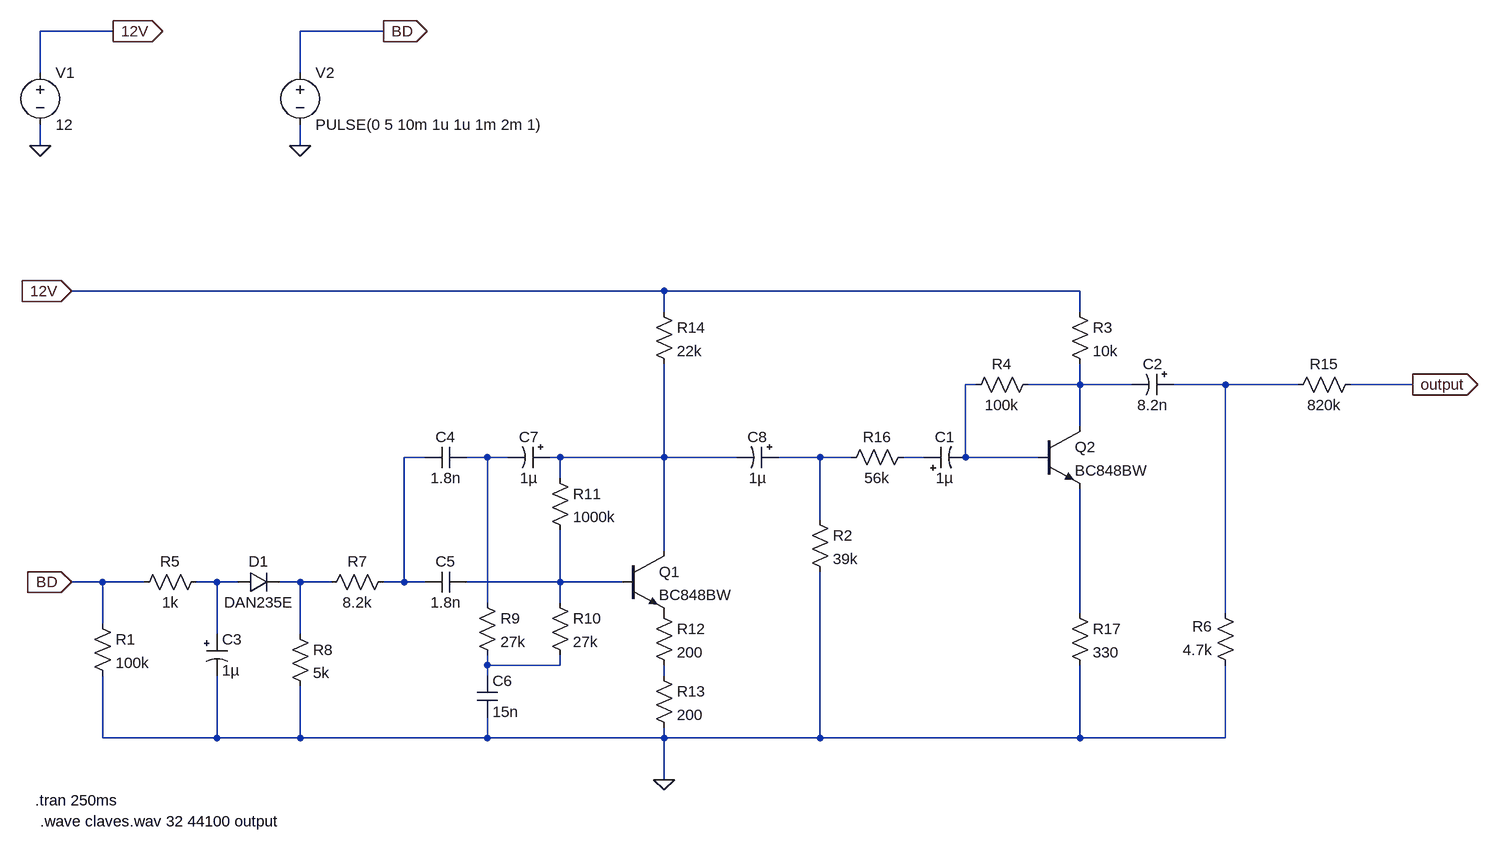
[diagram p0: schematic claves.asc]
claves.asc, the LTspice schematic file:
Version 4
SHEET 1 2960 680
WIRE 752 -880 640 -880
WIRE 1168 -880 1040 -880
WIRE 640 -816 640 -880
WIRE 1040 -816 1040 -880
WIRE 640 -704 640 -736
WIRE 1040 -704 1040 -736
WIRE 1600 -480 688 -480
WIRE 2240 -480 1600 -480
WIRE 1600 -448 1600 -480
WIRE 2240 -448 2240 -480
WIRE 2080 -336 2064 -336
WIRE 2240 -336 2240 -368
WIRE 2240 -336 2160 -336
WIRE 2320 -336 2240 -336
WIRE 2464 -336 2384 -336
WIRE 2576 -336 2464 -336
WIRE 2752 -336 2656 -336
WIRE 2240 -272 2240 -336
WIRE 1232 -224 1200 -224
WIRE 1328 -224 1296 -224
WIRE 1360 -224 1328 -224
WIRE 1440 -224 1424 -224
WIRE 1600 -224 1600 -368
WIRE 1600 -224 1440 -224
WIRE 1712 -224 1600 -224
WIRE 1840 -224 1776 -224
WIRE 1888 -224 1840 -224
WIRE 2000 -224 1968 -224
WIRE 2064 -224 2064 -336
WIRE 2176 -224 2064 -224
WIRE 1440 -192 1440 -224
WIRE 1840 -128 1840 -224
WIRE 1600 -80 1600 -224
WIRE 736 -32 688 -32
WIRE 800 -32 736 -32
WIRE 912 -32 880 -32
WIRE 944 -32 912 -32
WIRE 1040 -32 1008 -32
WIRE 1088 -32 1040 -32
WIRE 1200 -32 1200 -224
WIRE 1200 -32 1168 -32
WIRE 1232 -32 1200 -32
WIRE 1440 -32 1440 -112
WIRE 1440 -32 1296 -32
WIRE 1536 -32 1440 -32
WIRE 1328 0 1328 -224
WIRE 1440 0 1440 -32
WIRE 2240 16 2240 -176
WIRE 2464 16 2464 -336
WIRE 736 32 736 -32
WIRE 912 48 912 -32
WIRE 1040 48 1040 -32
WIRE 1328 96 1328 80
WIRE 1440 96 1440 80
WIRE 1440 96 1328 96
WIRE 1328 112 1328 96
WIRE 1600 112 1600 96
WIRE 736 208 736 112
WIRE 912 208 912 112
WIRE 912 208 736 208
WIRE 1040 208 1040 128
WIRE 1040 208 912 208
WIRE 1328 208 1328 176
WIRE 1328 208 1040 208
WIRE 1600 208 1600 192
WIRE 1600 208 1328 208
WIRE 1840 208 1840 -48
WIRE 1840 208 1600 208
WIRE 2240 208 2240 96
WIRE 2240 208 1840 208
WIRE 2464 208 2464 96
WIRE 2464 208 2240 208
WIRE 1600 272 1600 208
FLAG 752 -880 12V
IOPIN 752 -880 Out
FLAG 640 -704 0
FLAG 1168 -880 BD
IOPIN 1168 -880 Out
FLAG 1040 -704 0
FLAG 1600 272 0
FLAG 688 -480 12V
IOPIN 688 -480 In
FLAG 688 -32 BD
IOPIN 688 -32 In
FLAG 2752 -336 output
IOPIN 2752 -336 Out
SYMBOL res 1184 -48 R90
WINDOW 0 0 56 VBottom 2
WINDOW 3 32 56 VTop 2
SYMATTR InstName R7
SYMATTR Value 8.2k
SYMBOL cap 1296 -48 R90
WINDOW 0 0 32 VBottom 2
WINDOW 3 32 32 VTop 2
SYMATTR InstName C5
SYMATTR Value 1.8n
SYMBOL res 1024 32 R0
SYMATTR InstName R8
SYMATTR Value 5k
SYMBOL res 1312 -16 R0
SYMATTR InstName R9
SYMATTR Value 27k
SYMBOL cap 1312 112 R0
SYMATTR InstName C6
SYMATTR Value 15n
SYMBOL res 1424 -16 R0
SYMATTR InstName R10
SYMATTR Value 27k
SYMBOL res 1424 -208 R0
SYMATTR InstName R11
SYMATTR Value 1000k
SYMBOL res 1584 0 R0
SYMATTR InstName R12
SYMATTR Value 200
SYMBOL res 1584 96 R0
SYMATTR InstName R13
SYMATTR Value 200
SYMBOL voltage 640 -832 R0
WINDOW 123 0 0 Left 0
WINDOW 39 0 0 Left 0
SYMATTR InstName V1
SYMATTR Value 12
SYMBOL res 896 -48 R90
WINDOW 0 0 56 VBottom 2
WINDOW 3 32 56 VTop 2
SYMATTR InstName R5
SYMATTR Value 1k
SYMBOL polcap 896 48 R0
SYMATTR InstName C3
SYMATTR Value 1µ
SYMATTR SpiceLine V=10
SYMBOL diode 944 -16 R270
WINDOW 0 32 32 VTop 2
WINDOW 3 0 32 VBottom 2
SYMATTR InstName D1
SYMATTR Value DAN235E
SYMBOL cap 1296 -240 R90
WINDOW 0 0 32 VBottom 2
WINDOW 3 32 32 VTop 2
SYMATTR InstName C4
SYMATTR Value 1.8n
SYMBOL polcap 1424 -240 R90
WINDOW 0 0 32 VBottom 2
WINDOW 3 32 32 VTop 2
SYMATTR InstName C7
SYMATTR Value 1µ
SYMATTR SpiceLine V=25
SYMBOL polcap 1776 -240 R90
WINDOW 0 0 32 VBottom 2
WINDOW 3 32 32 VTop 2
SYMATTR InstName C8
SYMATTR Value 1µ
SYMATTR SpiceLine V=25
SYMBOL npn 1536 -80 R0
SYMATTR InstName Q1
SYMATTR Value BC848BW
SYMBOL res 1584 -464 R0
SYMATTR InstName R14
SYMATTR Value 22k
SYMBOL voltage 1040 -832 R0
WINDOW 123 0 0 Left 0
WINDOW 39 0 0 Left 0
SYMATTR InstName V2
SYMATTR Value PULSE(0 5 10m 1u 1u 1m 2m 1)
SYMBOL res 720 16 R0
SYMATTR InstName R1
SYMATTR Value 100k
SYMBOL res 1824 -144 R0
SYMATTR InstName R2
SYMATTR Value 39k
SYMBOL polcap 2000 -208 R270
WINDOW 0 32 32 VTop 2
WINDOW 3 0 32 VBottom 2
SYMATTR InstName C1
SYMATTR Value 1µ
SYMATTR SpiceLine V=25
SYMBOL npn 2176 -272 R0
SYMATTR InstName Q2
SYMATTR Value BC848BW
SYMBOL res 2224 -464 R0
SYMATTR InstName R3
SYMATTR Value 10k
SYMBOL res 2176 -352 R90
WINDOW 0 0 56 VBottom 2
WINDOW 3 32 56 VTop 2
SYMATTR InstName R4
SYMATTR Value 100k
SYMBOL res 2480 112 R180
WINDOW 0 36 76 Left 2
WINDOW 3 36 40 Left 2
SYMATTR InstName R6
SYMATTR Value 4.7k
SYMBOL polcap 2384 -352 R90
WINDOW 0 0 32 VBottom 2
WINDOW 3 32 32 VTop 2
SYMATTR InstName C2
SYMATTR Value 8.2n
SYMATTR SpiceLine V=25
SYMBOL res 2672 -352 R90
WINDOW 0 0 56 VBottom 2
WINDOW 3 32 56 VTop 2
SYMATTR InstName R15
SYMATTR Value 820k
SYMBOL res 1984 -240 R90
WINDOW 0 0 56 VBottom 2
WINDOW 3 32 56 VTop 2
SYMATTR InstName R16
SYMATTR Value 56k
SYMBOL res 2224 0 R0
SYMATTR InstName R17
SYMATTR Value 330
TEXT 632 304 Left 2 !.tran 250ms
TEXT 640 336 Left 2 !.wave claves.wav 32 44100 output

The netlist it stands for:
* claves.asc
R7 N004 N010 8.2k
C5 N011 N004 1.8n
R8 N010 0 5k
R9 N005 N013 27k
C6 N013 0 15n
R10 N011 N013 27k
R11 N006 N011 1000k
R12 P001 N014 200
R13 N014 0 200
V1 12V 0 12
R5 N009 BD 1k
C3 N009 0 1µ V=10
D1 N009 N010 DAN235E
C4 N005 N004 1.8n
C7 N006 N005 1µ V=25
C8 N007 N006 1µ V=25
Q1 N006 N011 P001 0 BC848BW
R14 12V N006 22k
V2 BD 0 PULSE(0 5 10m 1u 1u 1m 2m 1)
R1 BD 0 100k
R2 N007 0 39k
C1 N008 N001 1µ V=25
Q2 N002 N001 N012 0 BC848BW
R3 12V N002 10k
R4 N002 N001 100k
R6 0 N003 4.7k
C2 N003 N002 8.2n V=25
R15 output N003 820k
R16 N008 N007 56k
R17 N012 0 330
.model D D
.lib standard.dio
.model NPN NPN
.model PNP PNP
.lib standard.bjt
.tran 250ms
.wave claves.wav 32 44100 output
.backanno
.end